# Altium schematic sheet ZYNQ.SchDoc
size A2; SheetNumber: 3; SheetTotal: 7; SPICEModelCacheBIOPMTWN: <root> / <DocumentId>BIOPMTWN</DocumentId> / <CacheFrame Number="0"> / <Model Name="dpsw2" Kind="CKT"> / <Text>* DIP switch 2 / * jjt 19/6/2002: created / * / *             Switch connections: / *             sw1 / *             |  |  sw2 / *             |  |  |  | / *             |  |  |  | / .subckt dpsw2 1  2  4  5 / + PARAMS: STATE1=0 STATE2=0 RON=1m ROFF=100E6 / * / V1 3 0 {STATE1} / V2 6 0 {STATE2} / * / SDIP1 1 2 3 0 DIPMOD / SDIP2 4 5 6 0 DIPMOD / * / .MODEL DIPMOD SW(VT=0.5 RON={RON} ROFF={ROFF}) / .ends dpsw2</Text> / </Model> / </CacheFrame> / </root>
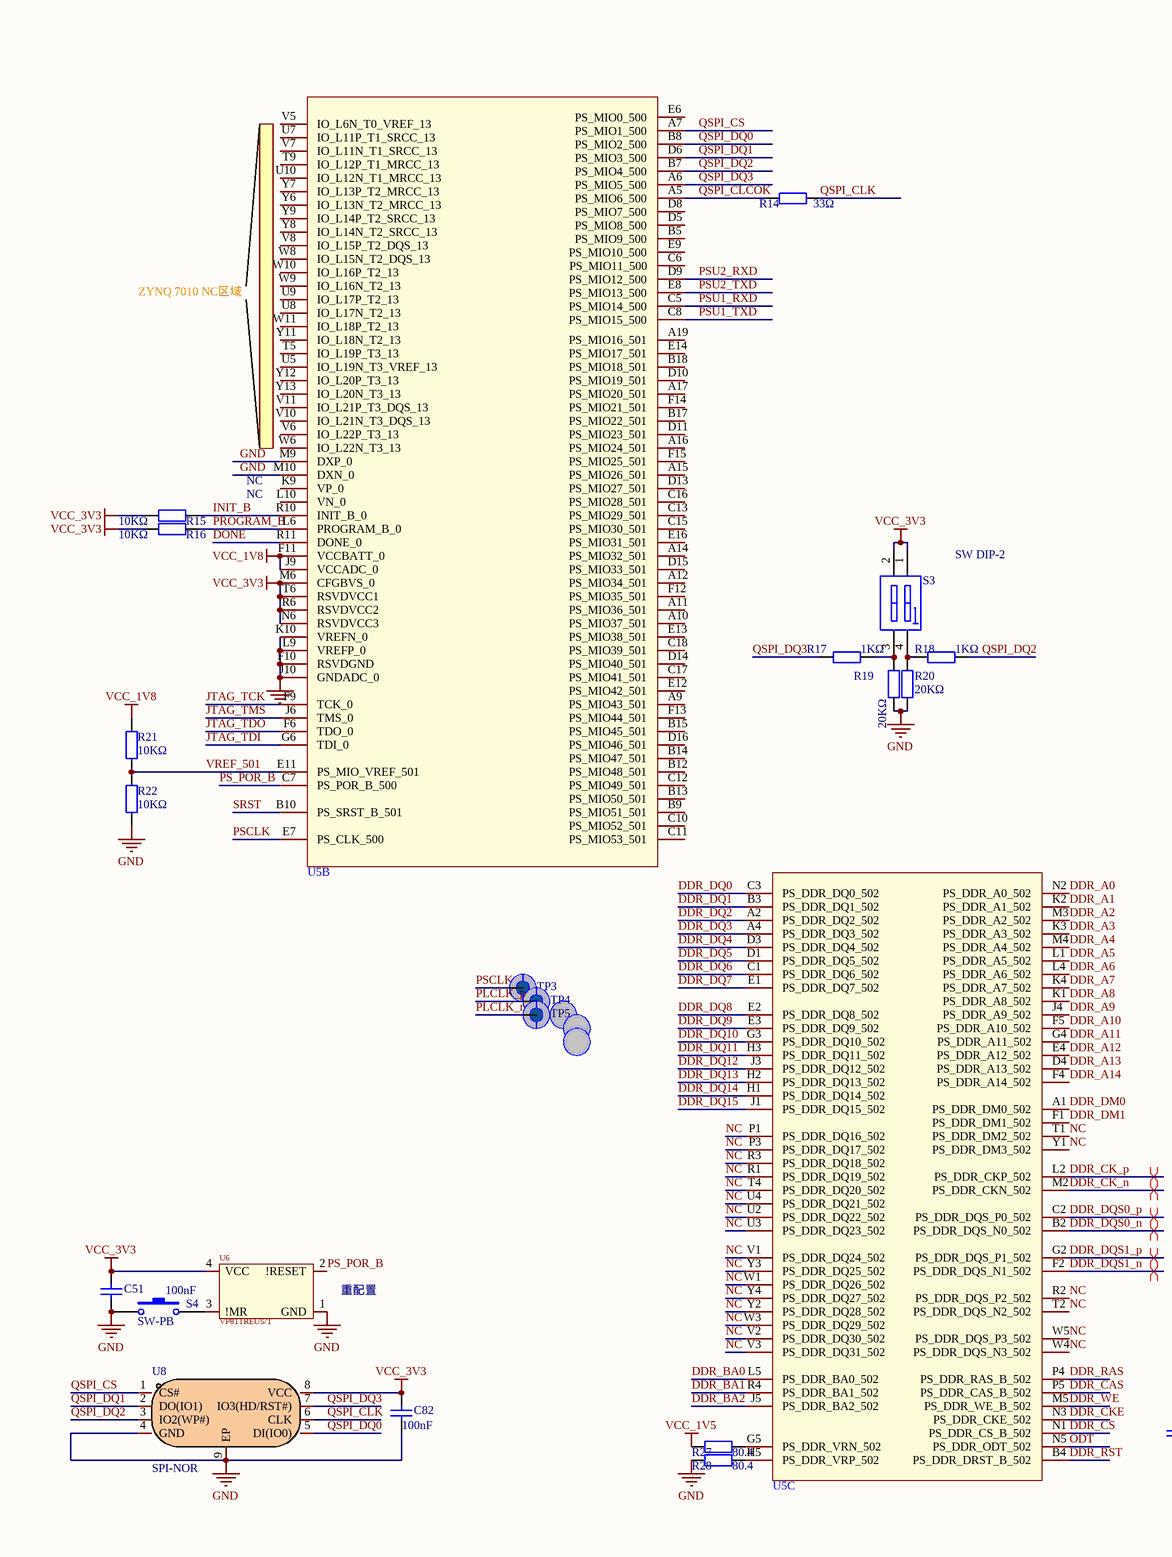
[diagram p0: ZYNQ.SchDoc, left]
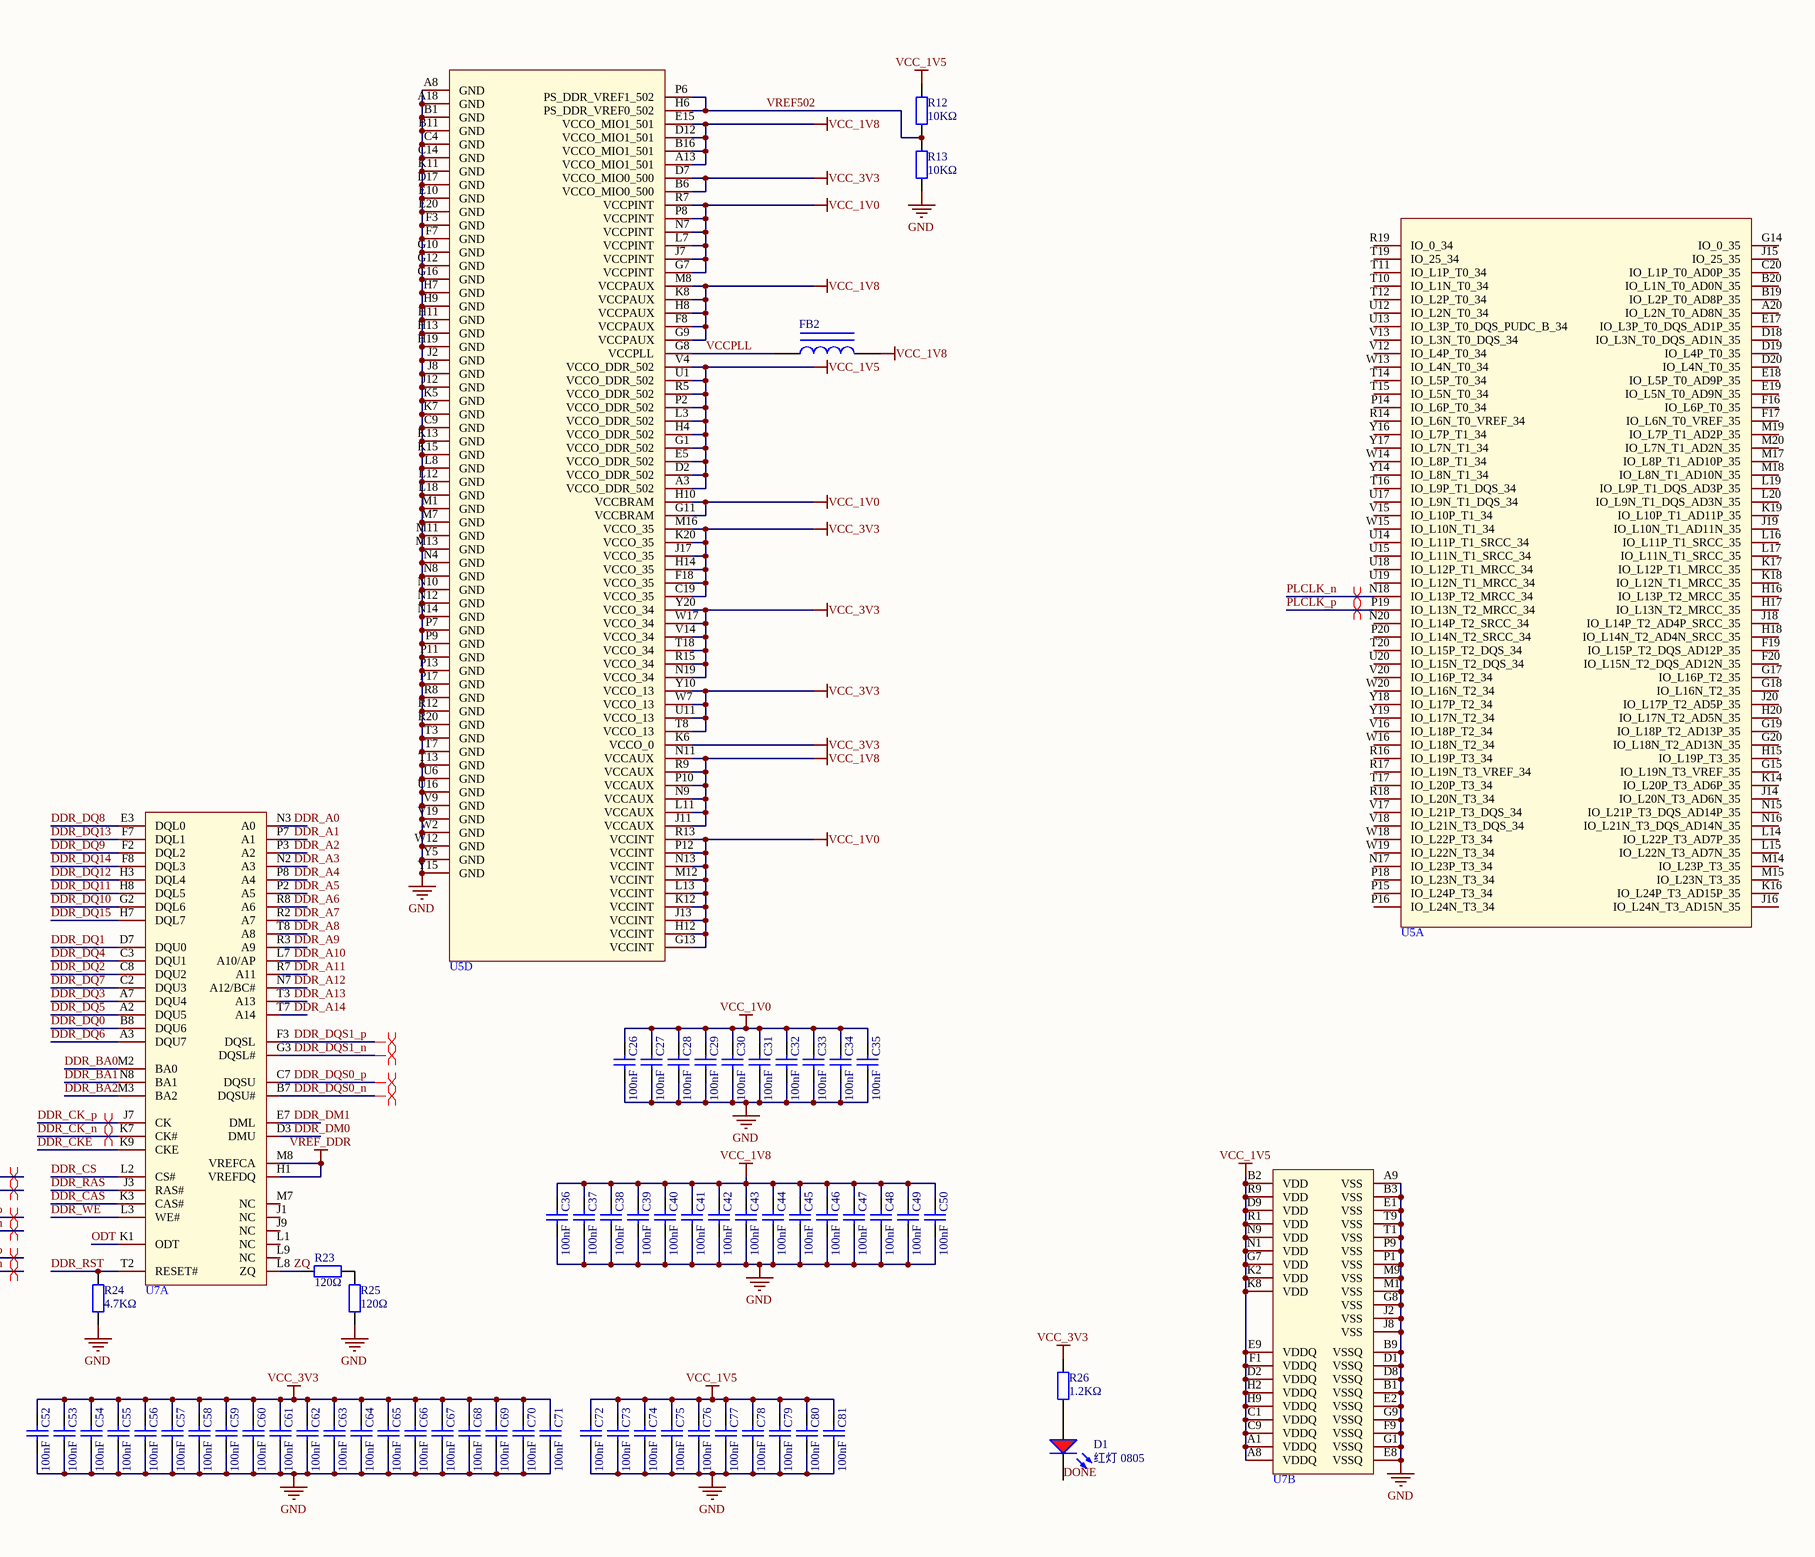
[diagram p1: ZYNQ.SchDoc, right]

## Parts
C26  100nF  [0201]
C27  100nF  [0201]
C28  100nF  [0201]
C29  100nF  [0201]
C30  100nF  [0201]
C31  100nF  [0201]
C32  100nF  [0201]
C33  100nF  [0201]
C34  100nF  [0201]
C35  100nF  [0201]
C36  100nF  [0201]
C37  100nF  [0201]
C38  100nF  [0201]
C39  100nF  [0201]
C40  100nF  [0201]
C41  100nF  [0201]
C42  100nF  [0201]
C43  100nF  [0201]
C44  100nF  [0201]
C45  100nF  [0201]
C46  100nF  [0201]
C47  100nF  [0201]
C48  100nF  [0201]
C49  100nF  [0201]
C50  100nF  [0201]
C51  100nF  [0805_C]
C52  100nF  [0201]
C53  100nF  [0201]
C54  100nF  [0201]
C55  100nF  [0201]
C56  100nF  [0201]
C57  100nF  [0201]
C58  100nF  [0201]
C59  100nF  [0201]
C60  100nF  [0201]
C61  100nF  [0201]
C62  100nF  [0201]
C63  100nF  [0201]
C64  100nF  [0201]
C65  100nF  [0201]
C66  100nF  [0201]
C67  100nF  [0201]
C68  100nF  [0201]
C69  100nF  [0201]
C70  100nF  [0201]
C71  100nF  [0201]
C72  100nF  [0201]
C73  100nF  [0201]
C74  100nF  [0201]
C75  100nF  [0201]
C76  100nF  [0201]
C77  100nF  [0201]
C78  100nF  [0201]
C79  100nF  [0201]
C80  100nF  [0201]
C81  100nF  [0201]
C82  100nF  [0805_C]
D1  红灯 0805  [0805_LED_S1]
FB2  100Ω ±25% 100MHz  [0805_L]  (value not drawn)
R12  10KΩ  [0201]
R13  10KΩ  [0201]
R14  33Ω  [0805_R]
R15  10KΩ  [0201]
R16  10KΩ  [0201]
R17  1KΩ  [0805_R]
R18  1KΩ  [0805_R]
R19  20KΩ  [0805_R]
R20  20KΩ  [0805_R]
R21  10KΩ  [0201]
R22  10KΩ  [0201]
R23  120Ω  [0805_R]
R24  4.7KΩ  [0805_R]
R25  120Ω  [0805_R]
R26  1.2KΩ  [0805_R]
R27  80.4  [0402_R]
R28  80.4  [0402_R]
S3  SW DIP-2  [SW-SMD_DSHP02TS-S]
S4  SW-PB  [SW-3*4-2P]
TP3  test-point  [POINT]  (value not drawn)
TP4  test-point  [POINT]  (value not drawn)
TP5  test-point  [POINT]  (value not drawn)
U5  XC7Z020-2CLG400I  [FBGA-400_L17.0-W17.0-R20-C20-P0.80-TL]  (value not drawn)  (parts A,B,C,D of 4)
U6  VP811REUS/T  [SOT-143_L2.9-W1.3-P1.92-LS2.3-BL]
U7  NT5CC256M16ER-EK  [TFBGA-96_L13.0-W8.0-R16-C6-P0.80-TL]  (value not drawn)  (parts A,B of 2)
U8  SPI-NOR  [WSON8]

## Nets
GND: C26.1 C27.1 C28.1 C29.1 C30.1 C31.1 C32.1 C33.1 C34.1 C35.1 C36.1 C37.1 C38.1 C39.1 C40.1 C41.1 C42.1 C43.1 C44.1 C45.1 C46.1 C47.1 C48.1 C49.1 C50.1 C51.1 C52.1 C53.1 C54.1 C55.1 C56.1 C57.1 C58.1 C59.1 C60.1 C61.1 C62.1 C63.1 C64.1 C65.1 C66.1 C67.1 C68.1 C69.1 C70.1 C71.1 C72.1 C73.1 C74.1 C75.1 C76.1 C77.1 C78.1 C79.1 C80.1 C81.1 C82.1 R13.1 R19.1 R20.1 R22.1 R24.1 R25.1 R28.1 S4.1 U5.A8(GND) U5.A18(GND) U5.B1(GND) U5.B11(GND) U5.C4(GND) U5.C9(GND) U5.C14(GND) U5.D17(GND) U5.E10(GND) U5.E20(GND) U5.F3(GND) U5.F7(GND) U5.F10(RSVDGND) U5.G10(GND) U5.G12(GND) U5.G16(GND) U5.H7(GND) U5.H9(GND) U5.H11(GND) U5.H13(GND) U5.H19(GND) U5.J2(GND) U5.J8(GND) U5.J10(GNDADC_0) U5.J12(GND) U5.K5(GND) U5.K7(GND) U5.K10(VREFN_0) U5.K11(GND) U5.K13(GND) U5.K15(GND) U5.L8(GND) U5.L9(VREFP_0) U5.L12(GND) U5.L18(GND) U5.M1(GND) U5.M7(GND) U5.M9(DXP_0) U5.M10(DXN_0) U5.M11(GND) U5.M13(GND) U5.N4(GND) U5.N8(GND) U5.N10(GND) U5.N12(GND) U5.N14(GND) U5.P7(GND) U5.P9(GND) U5.P11(GND) U5.P13(GND) U5.P17(GND) U5.R8(GND) U5.R12(GND) U5.R20(GND) U5.T3(GND) U5.T7(GND) U5.T13(GND) U5.U6(GND) U5.U16(GND) U5.V9(GND) U5.V19(GND) U5.W2(GND) U5.W12(GND) U5.Y5(GND) U5.Y15(GND) U6.1(GND) U7.A9(VSS) U7.B1(VSSQ) U7.B3(VSS) U7.B9(VSSQ) U7.D1(VSSQ) U7.D8(VSSQ) U7.E1(VSS) U7.E2(VSSQ) U7.E8(VSSQ) U7.F9(VSSQ) U7.G1(VSSQ) U7.G8(VSS) U7.G9(VSSQ) U7.J2(VSS) U7.J8(VSS) U7.M1(VSS) U7.M9(VSS) U7.P1(VSS) U7.P9(VSS) U7.T1(VSS) U7.T9(VSS) U8.4(GND) U8.9(EP)
VCC_1V0: C26.2 C27.2 C28.2 C29.2 C30.2 C31.2 C32.2 C33.2 C34.2 C35.2 U5.G7(VCCPINT) U5.G11(VCCBRAM) U5.G13(VCCINT) U5.H10(VCCBRAM) U5.H12(VCCINT) U5.J7(VCCPINT) U5.J13(VCCINT) U5.K12(VCCINT) U5.L7(VCCPINT) U5.L13(VCCINT) U5.M12(VCCINT) U5.N7(VCCPINT) U5.N13(VCCINT) U5.P8(VCCPINT) U5.P12(VCCINT) U5.R7(VCCPINT) U5.R13(VCCINT)
VCC_1V5: C72.2 C73.2 C74.2 C75.2 C76.2 C77.2 C78.2 C79.2 C80.2 C81.2 R12.2 R27.1 U5.A3(VCCO_DDR_502) U5.D2(VCCO_DDR_502) U5.E5(VCCO_DDR_502) U5.G1(VCCO_DDR_502) U5.H4(VCCO_DDR_502) U5.L3(VCCO_DDR_502) U5.P2(VCCO_DDR_502) U5.R5(VCCO_DDR_502) U5.U1(VCCO_DDR_502) U5.V4(VCCO_DDR_502) U7.A1(VDDQ) U7.A8(VDDQ) U7.B2(VDD) U7.C1(VDDQ) U7.C9(VDDQ) U7.D2(VDDQ) U7.D9(VDD) U7.E9(VDDQ) U7.F1(VDDQ) U7.G7(VDD) U7.H2(VDDQ) U7.H9(VDDQ) U7.K2(VDD) U7.K8(VDD) U7.N1(VDD) U7.N9(VDD) U7.R1(VDD) U7.R9(VDD)
VCC_1V8: C36.2 C37.2 C38.2 C39.2 C40.2 C41.2 C42.2 C43.2 C44.2 C45.2 C46.2 C47.2 C48.2 C49.2 C50.2 FB2.2 R21.2 U5.A13(VCCO_MIO1_501) U5.B16(VCCO_MIO1_501) U5.D12(VCCO_MIO1_501) U5.E15(VCCO_MIO1_501) U5.F8(VCCPAUX) U5.F11(VCCBATT_0) U5.G9(VCCPAUX) U5.H8(VCCPAUX) U5.J9(VCCADC_0) U5.J11(VCCAUX) U5.K8(VCCPAUX) U5.L11(VCCAUX) U5.M8(VCCPAUX) U5.N9(VCCAUX) U5.N11(VCCAUX) U5.P10(VCCAUX) U5.R9(VCCAUX)
VCC_3V3: C51.2 C52.2 C53.2 C54.2 C55.2 C56.2 C57.2 C58.2 C59.2 C60.2 C61.2 C62.2 C63.2 C64.2 C65.2 C66.2 C67.2 C68.2 C69.2 C70.2 C71.2 C82.2 R15.1 R16.1 R26.2 S3.1(A1) S3.2(A2) U5.B6(VCCO_MIO0_500) U5.C19(VCCO_35) U5.D7(VCCO_MIO0_500) U5.F18(VCCO_35) U5.H14(VCCO_35) U5.J17(VCCO_35) U5.K6(VCCO_0) U5.K20(VCCO_35) U5.M6(CFGBVS_0) U5.M16(VCCO_35) U5.N6(RSVDVCC3) U5.N19(VCCO_34) U5.R6(RSVDVCC2) U5.R15(VCCO_34) U5.T6(RSVDVCC1) U5.T8(VCCO_13) U5.T18(VCCO_34) U5.U11(VCCO_13) U5.V14(VCCO_34) U5.W7(VCCO_13) U5.W17(VCCO_34) U5.Y10(VCCO_13) U5.Y20(VCCO_34) U6.4(VCC) U8.8(VCC)
VREF_DDR: U7.H1(VREFDQ) U7.M8(VREFCA)
DDR_A0: U5.N2(PS_DDR_A0_502) U7.N3(A0)
DDR_A1: U5.K2(PS_DDR_A1_502) U7.P7(A1)
DDR_A2: U5.M3(PS_DDR_A2_502) U7.P3(A2)
DDR_A3: U5.K3(PS_DDR_A3_502) U7.N2(A3)
DDR_A4: U5.M4(PS_DDR_A4_502) U7.P8(A4)
DDR_A5: U5.L1(PS_DDR_A5_502) U7.P2(A5)
DDR_A6: U5.L4(PS_DDR_A6_502) U7.R8(A6)
DDR_A7: U5.K4(PS_DDR_A7_502) U7.R2(A7)
DDR_A8: U5.K1(PS_DDR_A8_502) U7.T8(A8)
DDR_A9: U5.J4(PS_DDR_A9_502) U7.R3(A9)
DDR_A10: U5.F5(PS_DDR_A10_502) U7.L7(A10/AP)
DDR_A11: U5.G4(PS_DDR_A11_502) U7.R7(A11)
DDR_A12: U5.E4(PS_DDR_A12_502) U7.N7(A12/BC#)
DDR_A13: U5.D4(PS_DDR_A13_502) U7.T3(A13)
DDR_A14: U5.F4(PS_DDR_A14_502) U7.T7(A14)
DDR_BA0: U5.L5(PS_DDR_BA0_502) U7.M2(BA0)
DDR_BA1: U5.R4(PS_DDR_BA1_502) U7.N8(BA1)
DDR_BA2: U5.J5(PS_DDR_BA2_502) U7.M3(BA2)
DDR_CAS: U5.P5(PS_DDR_CAS_B_502) U7.K3(CAS#)
DDR_CK_n: U5.M2(PS_DDR_CKN_502) U7.K7(CK#)
DDR_CK_p: U5.L2(PS_DDR_CKP_502) U7.J7(CK)
DDR_CKE: U5.N3(PS_DDR_CKE_502) U7.K9(CKE)
DDR_CS: U5.N1(PS_DDR_CS_B_502) U7.L2(CS#)
DDR_DM0: U5.A1(PS_DDR_DM0_502) U7.D3(DMU)
DDR_DM1: U5.F1(PS_DDR_DM1_502) U7.E7(DML)
DDR_DQ0: U5.C3(PS_DDR_DQ0_502) U7.B8(DQU6)
DDR_DQ1: U5.B3(PS_DDR_DQ1_502) U7.D7(DQU0)
DDR_DQ2: U5.A2(PS_DDR_DQ2_502) U7.C8(DQU2)
DDR_DQ3: U5.A4(PS_DDR_DQ3_502) U7.A7(DQU4)
DDR_DQ4: U5.D3(PS_DDR_DQ4_502) U7.C3(DQU1)
DDR_DQ5: U5.D1(PS_DDR_DQ5_502) U7.A2(DQU5)
DDR_DQ6: U5.C1(PS_DDR_DQ6_502) U7.A3(DQU7)
DDR_DQ7: U5.E1(PS_DDR_DQ7_502) U7.C2(DQU3)
DDR_DQ8: U5.E2(PS_DDR_DQ8_502) U7.E3(DQL0)
DDR_DQ9: U5.E3(PS_DDR_DQ9_502) U7.F2(DQL2)
DDR_DQ10: U5.G3(PS_DDR_DQ10_502) U7.G2(DQL6)
DDR_DQ11: U5.H3(PS_DDR_DQ11_502) U7.H8(DQL5)
DDR_DQ12: U5.J3(PS_DDR_DQ12_502) U7.H3(DQL4)
DDR_DQ13: U5.H2(PS_DDR_DQ13_502) U7.F7(DQL1)
DDR_DQ14: U5.H1(PS_DDR_DQ14_502) U7.F8(DQL3)
DDR_DQ15: U5.J1(PS_DDR_DQ15_502) U7.H7(DQL7)
DDR_DQS0_n: U5.B2(PS_DDR_DQS_N0_502) U7.B7(DQSU#)
DDR_DQS0_p: U5.C2(PS_DDR_DQS_P0_502) U7.C7(DQSU)
DDR_DQS1_n: U5.F2(PS_DDR_DQS_N1_502) U7.G3(DQSL#)
DDR_DQS1_p: U5.G2(PS_DDR_DQS_P1_502) U7.F3(DQSL)
DDR_RAS: U5.P4(PS_DDR_RAS_B_502) U7.J3(RAS#)
DDR_RST: R24.2 U5.B4(PS_DDR_DRST_B_502) U7.T2(RESET#)
DDR_WE: U5.M5(PS_DDR_WE_B_502) U7.L3(WE#)
DONE: D1.K U5.R11(DONE_0)
INIT_B: R15.2 U5.R10(INIT_B_0)
JTAG_TCK: U5.F9(TCK_0)
JTAG_TDI: U5.G6(TDI_0)
JTAG_TDO: U5.F6(TDO_0)
JTAG_TMS: U5.J6(TMS_0)
NC: U5.P1(PS_DDR_DQ16_502) U5.P3(PS_DDR_DQ17_502) U5.R1(PS_DDR_DQ19_502) U5.R2(PS_DDR_DQS_P2_502) U5.R3(PS_DDR_DQ18_502) U5.T1(PS_DDR_DM2_502) U5.T2(PS_DDR_DQS_N2_502) U5.T4(PS_DDR_DQ20_502) U5.U2(PS_DDR_DQ22_502) U5.U3(PS_DDR_DQ23_502) U5.U4(PS_DDR_DQ21_502) U5.V1(PS_DDR_DQ24_502) U5.V2(PS_DDR_DQ30_502) U5.V3(PS_DDR_DQ31_502) U5.W1(PS_DDR_DQ26_502) U5.W3(PS_DDR_DQ29_502) U5.W4(PS_DDR_DQS_N3_502) U5.W5(PS_DDR_DQS_P3_502) U5.Y1(PS_DDR_DM3_502) U5.Y2(PS_DDR_DQ28_502) U5.Y3(PS_DDR_DQ25_502) U5.Y4(PS_DDR_DQ27_502)
ODT: U5.N5(PS_DDR_ODT_502) U7.K1(ODT)
PLCLK_n: TP5.1(point) U5.N18(IO_L13P_T2_MRCC_34)
PLCLK_p: TP4.1(point) U5.P19(IO_L13N_T2_MRCC_34)
PROGRAM_B: R16.2 U5.L6(PROGRAM_B_0)
PS_POR_B: U5.C7(PS_POR_B_500) U6.2(!RESET)
PSCLK: TP3.1(point) U5.E7(PS_CLK_500)
PSU1_RXD: U5.C5(PS_MIO14_500)
PSU1_TXD: U5.C8(PS_MIO15_500)
PSU2_RXD: U5.D9(PS_MIO12_500)
PSU2_TXD: U5.E8(PS_MIO13_500)
QSPI_CLCOK: R14.1 U5.A5(PS_MIO6_500)
QSPI_CLK: R14.2 U8.6(CLK)
QSPI_CS: U5.A7(PS_MIO1_500) U8.1(CS#)
QSPI_DQ0: U5.B8(PS_MIO2_500) U8.5(DI(IO0))
QSPI_DQ1: U5.D6(PS_MIO3_500) U8.2(DO(IO1))
QSPI_DQ2: R18.2 U5.B7(PS_MIO4_500) U8.3(IO2(WP#))
QSPI_DQ3: R17.1 U5.A6(PS_MIO5_500) U8.7(IO3(HD/RST#))
SRST: U5.B10(PS_SRST_B_501)
VCCPLL: FB2.1 U5.G8(VCCPLL)
VREF502: R12.1 R13.2 U5.H6(PS_DDR_VREF0_502) U5.P6(PS_DDR_VREF1_502)
VREF_501: R21.1 R22.2 U5.E11(PS_MIO_VREF_501)
ZQ: R23.1 U7.L8(ZQ)
NetD1_A: D1.A R26.1
NetR17_2: R17.2 R19.2 S3.3(B2)
NetR18_1: R18.1 R20.2 S3.4(B1)
NetR23_2: R23.2 R25.2
NetR27_2: R27.2 U5.G5(PS_DDR_VRN_502)
NetR28_2: R28.2 U5.H5(PS_DDR_VRP_502)
NetS4_2: S4.2 U6.3(!MR)

Not connected (* = marked no-connect by the designer): U5 A9(PS_MIO43_501) A10(PS_MIO37_501) A11(PS_MIO36_501) A12(PS_MIO34_501) A14(PS_MIO32_501) A15(PS_MIO26_501) A16(PS_MIO24_501) A17(PS_MIO20_501) A19(PS_MIO16_501) A20(IO_L2N_T0_AD8N_35) B5(PS_MIO9_500) B9(PS_MIO51_501) B12(PS_MIO48_501) B13(PS_MIO50_501) B14(PS_MIO47_501) B15(PS_MIO45_501) B17(PS_MIO22_501) B18(PS_MIO18_501) B19(IO_L2P_T0_AD8P_35) B20(IO_L1N_T0_AD0N_35) C6(PS_MIO11_500) C10(PS_MIO52_501) C11(PS_MIO53_501) C12(PS_MIO49_501) C13(PS_MIO29_501) C15(PS_MIO30_501) C16(PS_MIO28_501) C17(PS_MIO41_501) C18(PS_MIO39_501) C20(IO_L1P_T0_AD0P_35) D5(PS_MIO8_500) D8(PS_MIO7_500) D10(PS_MIO19_501) D11(PS_MIO23_501) D13(PS_MIO27_501) D14(PS_MIO40_501) D15(PS_MIO33_501) D16(PS_MIO46_501) D18(IO_L3N_T0_DQS_AD1N_35) D19(IO_L4P_T0_35) D20(IO_L4N_T0_35) E6(PS_MIO0_500) E9(PS_MIO10_500) E12(PS_MIO42_501) E13(PS_MIO38_501) E14(PS_MIO17_501) E16(PS_MIO31_501) E17(IO_L3P_T0_DQS_AD1P_35) E18(IO_L5P_T0_AD9P_35) E19(IO_L5N_T0_AD9N_35) F12(PS_MIO35_501) F13(PS_MIO44_501) F14(PS_MIO21_501) F15(PS_MIO25_501) F16(IO_L6P_T0_35) F17(IO_L6N_T0_VREF_35) F19(IO_L15P_T2_DQS_AD12P_35) F20(IO_L15N_T2_DQS_AD12N_35) G14(IO_0_35) G15(IO_L19N_T3_VREF_35) G17(IO_L16P_T2_35) G18(IO_L16N_T2_35) G19(IO_L18P_T2_AD13P_35) G20(IO_L18N_T2_AD13N_35) H15(IO_L19P_T3_35) H16(IO_L13P_T2_MRCC_35) H17(IO_L13N_T2_MRCC_35) H18(IO_L14N_T2_AD4N_SRCC_35) H20(IO_L17N_T2_AD5N_35) J14(IO_L20N_T3_AD6N_35) J15(IO_25_35) J16(IO_L24N_T3_AD15N_35) J18(IO_L14P_T2_AD4P_SRCC_35) J19(IO_L10N_T1_AD11N_35) J20(IO_L17P_T2_AD5P_35) K9(VP_0) K14(IO_L20P_T3_AD6P_35) K16(IO_L24P_T3_AD15P_35) K17(IO_L12P_T1_MRCC_35) K18(IO_L12N_T1_MRCC_35) K19(IO_L10P_T1_AD11P_35) L10(VN_0) L14(IO_L22P_T3_AD7P_35) L15(IO_L22N_T3_AD7N_35) L16(IO_L11P_T1_SRCC_35) L17(IO_L11N_T1_SRCC_35) L19(IO_L9P_T1_DQS_AD3P_35) L20(IO_L9N_T1_DQS_AD3N_35) M14(IO_L23P_T3_35) M15(IO_L23N_T3_35) M17(IO_L8P_T1_AD10P_35) M18(IO_L8N_T1_AD10N_35) M19(IO_L7P_T1_AD2P_35) M20(IO_L7N_T1_AD2N_35) N15(IO_L21P_T3_DQS_AD14P_35) N16(IO_L21N_T3_DQS_AD14N_35) N17(IO_L23P_T3_34) N20(IO_L14P_T2_SRCC_34) P14(IO_L6P_T0_34) P15(IO_L24P_T3_34) P16(IO_L24N_T3_34) P18(IO_L23N_T3_34) P20(IO_L14N_T2_SRCC_34) R14(IO_L6N_T0_VREF_34) R16(IO_L19P_T3_34) R17(IO_L19N_T3_VREF_34) R18(IO_L20N_T3_34) R19(IO_0_34) T5(IO_L19P_T3_13) T9(IO_L12P_T1_MRCC_13) T10(IO_L1N_T0_34) T11(IO_L1P_T0_34) T12(IO_L2P_T0_34) T14(IO_L5P_T0_34) T15(IO_L5N_T0_34) T16(IO_L9P_T1_DQS_34) T17(IO_L20P_T3_34) T19(IO_25_34) T20(IO_L15P_T2_DQS_34) U5(IO_L19N_T3_VREF_13) U7(IO_L11P_T1_SRCC_13) U8(IO_L17N_T2_13) U9(IO_L17P_T2_13) U10(IO_L12N_T1_MRCC_13) U12(IO_L2N_T0_34) U13(IO_L3P_T0_DQS_PUDC_B_34) U14(IO_L11P_T1_SRCC_34) U15(IO_L11N_T1_SRCC_34) U17(IO_L9N_T1_DQS_34) U18(IO_L12P_T1_MRCC_34) U19(IO_L12N_T1_MRCC_34) U20(IO_L15N_T2_DQS_34) V5(IO_L6N_T0_VREF_13) V6(IO_L22P_T3_13) V7(IO_L11N_T1_SRCC_13) V8(IO_L15P_T2_DQS_13) V10(IO_L21N_T3_DQS_13) V11(IO_L21P_T3_DQS_13) V12(IO_L4P_T0_34) V13(IO_L3N_T0_DQS_34) V15(IO_L10P_T1_34) V16(IO_L18P_T2_34) V17(IO_L21P_T3_DQS_34) V18(IO_L21N_T3_DQS_34) V20(IO_L16P_T2_34) W6(IO_L22N_T3_13) W8(IO_L15N_T2_DQS_13) W9(IO_L16N_T2_13) W10(IO_L16P_T2_13) W11(IO_L18P_T2_13) W13(IO_L4N_T0_34) W14(IO_L8P_T1_34) W15(IO_L10N_T1_34) W16(IO_L18N_T2_34) W18(IO_L22P_T3_34) W19(IO_L22N_T3_34) W20(IO_L16N_T2_34) Y6(IO_L13N_T2_MRCC_13) Y7(IO_L13P_T2_MRCC_13) Y8(IO_L14N_T2_SRCC_13) Y9(IO_L14P_T2_SRCC_13) Y11(IO_L18N_T2_13) Y12(IO_L20P_T3_13) Y13(IO_L20N_T3_13) Y14(IO_L8N_T1_34) Y16(IO_L7P_T1_34) Y17(IO_L7N_T1_34) Y18(IO_L17P_T2_34) Y19(IO_L17N_T2_34); U7 J1(NC) J9(NC) L1(NC) L9(NC) M7(NC)

## Layout directives
differential pair: DDR_CK_n, DDR_CK_p, DDR_DQS0_n, DDR_DQS0_p, DDR_DQS1_n, DDR_DQS1_p, PLCLK_n, PLCLK_p

## Notes on the sheet
- ZYNQ 7010 NC区域
- NC
- (near U6) 重配置

## Library data of the parts
C26-C82 = 0402 100nF (104) 10% 16V: 贴片电容; ComponentLink1Description: 供应商链接; ComponentLink1URL: http://www.szlcsc.com/product/details_1877.html; Package: 0402; Supplier: LC; SuppliersPartNumber: C1525
D1 = 0805 红灯: 发光二极管; ComponentLink1Description: 供应商链接; ComponentLink1URL: http://www.szlcsc.com/product/details_2668.html; Package: 0805; Supplier: LC; SuppliersPartNumber: C2295
FB2 = 0805 100Ω 25% 100MHz: 贴片磁珠; ComponentLink1Description: 供应商链接; ComponentLink1URL: http://www.szlcsc.com/product/details_1367.html; Package: 0805; Supplier: LC; SuppliersPartNumber: C1015
R12 R13 R21 R22 = 0805 10KΩ (1002) 1%: 贴片电阻; ComponentLink1Description: 供应商链接; ComponentLink1URL: http://www.szlcsc.com/product/details_18102.html; Package: 0805; Supplier: LC; SuppliersPartNumber: C17414
R14 = 0402 33Ω (33R0) 1%: 贴片电阻; ComponentLink1Description: 供应商链接; ComponentLink1URL: http://www.szlcsc.com/product/details_25848.html; Package: 0402; Supplier: LC; SuppliersPartNumber: C25105
R15 R16 R24 = 0402 4.7KΩ (4701) 1%: 贴片电阻; ComponentLink1Description: 供应商链接; ComponentLink1URL: http://www.szlcsc.com/product/details_26643.html; Package: 0402; Supplier: LC; SuppliersPartNumber: C25900
R17 R18 = 0402 10KΩ (1002) 1%: 贴片电阻; ComponentLink1Description: 供应商链接; ComponentLink1URL: http://www.szlcsc.com/product/details_26487.html; Package: 0402; Supplier: LC; SuppliersPartNumber: C25744
R19 R20 = 0402 20KΩ (2002) 1%: 贴片电阻; ComponentLink1Description: 供应商链接; ComponentLink1URL: http://www.szlcsc.com/product/details_26508.html; Package: 0402; Supplier: LC; SuppliersPartNumber: C25765
R23 R25 = 0402 120Ω (1200) 1%: 贴片电阻; ComponentLink1Description: 供应商链接; ComponentLink1URL: http://www.szlcsc.com/product/details_25822.html; Package: 0402; Supplier: LC; SuppliersPartNumber: C25079
R26 = 0805 1.2KΩ (1201) 1%: 贴片电阻; ComponentLink1Description: 供应商链接; ComponentLink1URL: http://www.szlcsc.com/product/details_18067.html; Package: 0805; Supplier: LC; SuppliersPartNumber: C17379
R27 R28 = 0402 0Ω (0R0) 1%: 贴片电阻; ComponentLink1Description: 供应商链接; ComponentLink1URL: http://www.szlcsc.com/product/details_17853.html; Package: 0402; Supplier: LC; SuppliersPartNumber: C17168
S3 = SW DIP-2: DIP Switch, 2 Position, SPST; Published: 24-Mar-1999; LatestRevisionDate: 17-Jul-2002; LatestRevisionNote: Re-released for DXP Platform.; PackageReference: DIP-4; Publisher: Altium Limited
S4 = SW-PB: Switch; Published: 24-Mar-1999; LatestRevisionDate: 17-Jul-2002; LatestRevisionNote: Re-released for DXP Platform.; PackageReference: SPST-2; Publisher: Altium Limited; PackageDescription: Switch; 2 Leads
TP3-TP5 = test-point: 测试点
U5 = XC7Z020-2CLG400I: Manufacturer: XILINX(赛灵思); Convert to PCB: yes; Symbol: XC7Z020-2CLG400I; Device: XC7Z020-2CLG400I; Add into BOM: yes; Supplier: LCSC; Supplier Part: C569043; Supplier Footprint: CSPBGA-400; JLCPCB Part Class: 扩展库; LCSC Part Name: -; Datasheet: https://atta.szlcsc.com/upload/public/pdf/source/20191108/C446028_7ED8319F1F88212BA1E5D387DA4ECDB9.pdf; Manufacturer Part: XC7Z020-2CLG400I
U6 = VP811REUS/T: 复位电平管理芯片; Manufacturer: VP(中芯集成); Add into BOM: yes; ChipType: 电源监控器; Output Type: 开漏; Reset Active Level: 低电平有效; Number of Voltages Monitored: 1; Manual Reset: 有; Watchdog: 无; Symbol: VP811REUS/T; Device: VP811REUS/T; LCSC Part Name: VP811REUS/T; Supplier Part: C381485; Manufacturer Part: VP811REUS/T; Supplier Footprint: SOT-143; JLCPCB Part Class: Extended Part; Datasheet: https://atta.szlcsc.com/upload/public/pdf/source/20190322/C381486_AD49D5EAA1071F589CB38927003B9E48.pdf; Supplier: LCSC; Convert to PCB: yes; Operating Temperature: -40℃~+125℃@(Tj)
U7 = 4Gbit DDR3L BGA-96: Manufacturer: Nanya(南亚科技); Symbol: 4Gbt  DDR3L BGA-96; Add into BOM: yes; Device: 4Gbit DDR3L BGA-96; LCSC Part Name: NT5CC256M16ER-EK; Supplier Part: C428584; Manufacturer Part: NT5CC256M16ER-EK; Supplier Footprint: TFBGA-96; JLCPCB Part Class: 扩展库; Datasheet: https://atta.szlcsc.com/upload/public/pdf/source/20190912/C428584_C33860C5A34E1626944F37A05F9FF64A.pdf; Supplier: LCSC; Convert to PCB: yes
U8 = W25Q64: NOR FLASH